# Altium schematic sheet coremodule.schdoc: Core Module
size 431 x 279 mm; DrawnBy: D. Bruey, M.Ciuffo; Organization: Synapse Product Development, LLC.; Address1: 1511 6th Ave., Suite 400; Address2: Seattle, Washington 98101; Address3: 206.381.0898; Address4: www.synapse.com; SheetNumber: 2; SheetTotal: 10; PageSetup: Record=PageOptions|CenterHorizontal=True|CenterVertical=True|PrintScale=1.06|XCorrection=1.00|YCorrection=1.00|PrintKind=1|BorderSize=5000000|LeftOffset=0|BottomOffset=0|Orientation=2|PaperLength=4318|PaperWidth=2794|Scale=100|PaperSource=7|PrintQuality=200|MediaType=1|DitherType=10|PrintScaleMode=1|PaperKind=11x17|PaperIndex=3
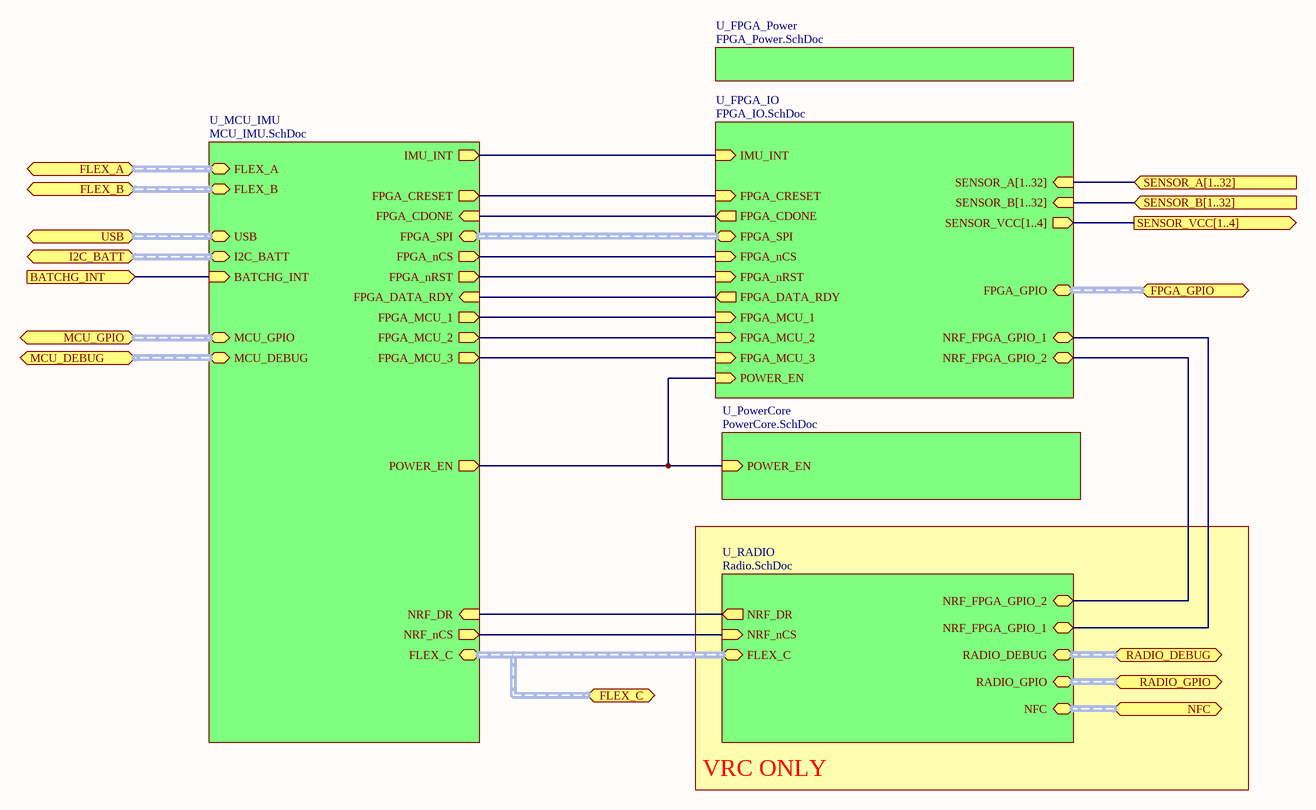
[diagram p0: coremodule.schdoc]

## Sub-sheets
U_FPGA_IO = FPGA_IO.SchDoc: FPGA_SPI (harness SPI), FPGA_nCS (in), IMU_INT (in), POWER_EN (in), FPGA_GPIO (harness FPGA_IO), FPGA_MCU_1 (in), FPGA_MCU_2 (in), FPGA_MCU_3 (in), FPGA_nRST (in), FPGA_CRESET (in), FPGA_DATA_RDY (out), FPGA_CDONE (out), NRF_FPGA_GPIO_1 (bidir), NRF_FPGA_GPIO_2 (bidir), SENSOR_VCC[1..4] (out), SENSOR_B[1..32] (in), SENSOR_A[1..32] (in)
U_FPGA_Power = FPGA_Power.SchDoc: no entries
U_MCU_IMU = MCU_IMU.SchDoc: I2C_BATT (harness I2C), USB (harness USB), FLEX_A (harness SPI), FLEX_B (harness SPI), FLEX_C (harness SPI), FPGA_SPI (harness SPI), FPGA_nCS (out), IMU_INT (out), POWER_EN (out), NRF_DR (in), MCU_GPIO (harness MCU_IO), NRF_nCS (out), BATCHG_INT (in), FPGA_MCU_1 (out), FPGA_MCU_2 (out), FPGA_MCU_3 (out), FPGA_nRST (out), FPGA_DATA_RDY (in), FPGA_CRESET (out), FPGA_CDONE (in), MCU_DEBUG (harness SWD)
U_PowerCore = PowerCore.SchDoc: POWER_EN (in)
U_RADIO = Radio.SchDoc: NRF_nCS (in), RADIO_DEBUG (harness SWD), FLEX_C (harness SPI), RADIO_GPIO (harness RADIO_IO), NFC (harness NFC), NRF_FPGA_GPIO_1 (bidir), NRF_FPGA_GPIO_2 (bidir), NRF_DR (out)

## Ports
BATCHG_INT (in), FLEX_A (harness SPI), FLEX_B (harness SPI), FLEX_C (harness SPI), FPGA_GPIO (harness FPGA_IO), I2C_BATT (harness I2C), MCU_DEBUG (harness SWD), MCU_GPIO (harness MCU_IO), NFC (harness NFC), RADIO_DEBUG (harness SWD), RADIO_GPIO (harness RADIO_IO), SENSOR_A[1..32] (in), SENSOR_B[1..32] (in), SENSOR_VCC[1..4] (out), USB (harness USB)

## Nets
BATCHG_INT: port BATCHG_INT, sheet U_MCU_IMU/BATCHG_INT
(unnamed): sheet U_FPGA_IO/FPGA_nCS, sheet U_MCU_IMU/FPGA_nCS
(unnamed): sheet U_FPGA_IO/IMU_INT, sheet U_MCU_IMU/IMU_INT
(unnamed): sheet U_FPGA_IO/POWER_EN, sheet U_PowerCore/POWER_EN, sheet U_MCU_IMU/POWER_EN
(unnamed): sheet U_FPGA_IO/FPGA_MCU_1, sheet U_MCU_IMU/FPGA_MCU_1
(unnamed): sheet U_FPGA_IO/FPGA_MCU_2, sheet U_MCU_IMU/FPGA_MCU_2
(unnamed): sheet U_FPGA_IO/FPGA_MCU_3, sheet U_MCU_IMU/FPGA_MCU_3
(unnamed): sheet U_FPGA_IO/FPGA_nRST, sheet U_MCU_IMU/FPGA_nRST
(unnamed): sheet U_FPGA_IO/FPGA_CRESET, sheet U_MCU_IMU/FPGA_CRESET
(unnamed): sheet U_FPGA_IO/FPGA_DATA_RDY, sheet U_MCU_IMU/FPGA_DATA_RDY
(unnamed): sheet U_FPGA_IO/FPGA_CDONE, sheet U_MCU_IMU/FPGA_CDONE
(unnamed): sheet U_FPGA_IO/NRF_FPGA_GPIO_1, sheet U_RADIO/NRF_FPGA_GPIO_1
(unnamed): sheet U_FPGA_IO/NRF_FPGA_GPIO_2, sheet U_RADIO/NRF_FPGA_GPIO_2
(unnamed): sheet U_MCU_IMU/NRF_DR, sheet U_RADIO/NRF_DR
(unnamed): sheet U_MCU_IMU/NRF_nCS, sheet U_RADIO/NRF_nCS

## Buses and harness runs
bus port SENSOR_A[1..32] = sheet U_FPGA_IO/SENSOR_A[1..32]
bus port SENSOR_B[1..32] = sheet U_FPGA_IO/SENSOR_B[1..32]
bus port SENSOR_VCC[1..4] = sheet U_FPGA_IO/SENSOR_VCC[1..4]
harness port FLEX_A = sheet U_MCU_IMU/FLEX_A
harness port FLEX_B = sheet U_MCU_IMU/FLEX_B
harness port FLEX_C = sheet U_MCU_IMU/FLEX_C = sheet U_RADIO/FLEX_C
harness port FPGA_GPIO = sheet U_FPGA_IO/FPGA_GPIO
harness port I2C_BATT = sheet U_MCU_IMU/I2C_BATT
harness port MCU_DEBUG = sheet U_MCU_IMU/MCU_DEBUG
harness port MCU_GPIO = sheet U_MCU_IMU/MCU_GPIO
harness port NFC = sheet U_RADIO/NFC
harness port RADIO_DEBUG = sheet U_RADIO/RADIO_DEBUG
harness port RADIO_GPIO = sheet U_RADIO/RADIO_GPIO
harness port USB = sheet U_MCU_IMU/USB
harness sheet U_FPGA_IO/FPGA_SPI = sheet U_MCU_IMU/FPGA_SPI

## Notes on the sheet
- VRC ONLY
- Design Notes:
- Layout Notes:
- Project:
- Sheet Title:
- PCBA:
- PROPRIETARY AND CONFIDENTIAL
- Drawn by:
- Schematic Part Number:
- Schematic Revision:
- Date:
- Sheet:
- /